# EAGLE design Main (EAGLE 7.6.0)
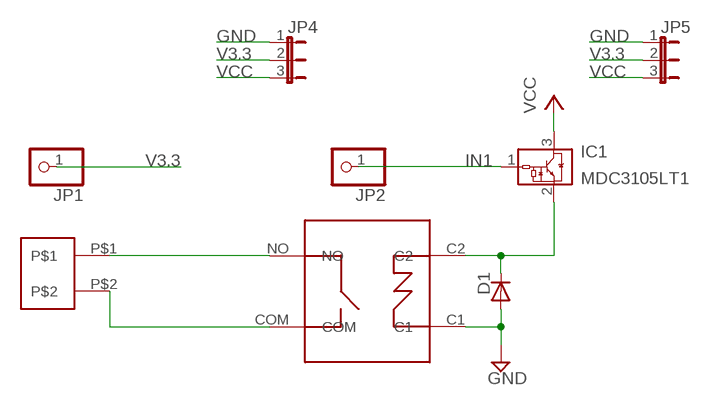
[diagram p0: schematic, sheet 1]

## Parts
D1  DIODE-SOD123  [SOD123]
IC1  MDC3105LT1  [SOT23]
JP1  PINHD-1X1  [1X01]
JP2  PINHD-1X1  [1X01]
JP4  JP2E  [JP2]
JP5  JP2E  [JP2]
REL1  ALQ305  [ALQ305]
U$2  1713017  [1713017]

## Nets
GND [PWR]: D1.A JP4.1 JP5.1 REL1.C1
IN1: IC1.1(VIN) JP2.1
N$1: D1.C IC1.2(GND) REL1.C2
P$1: REL1.NO U$2.P$1
P$2: REL1.COM U$2.P$2
V3.3 [PWR]: JP1.1 JP4.2 JP5.2
VCC [PWR]: IC1.3(VOUT) JP4.3 JP5.3

## Library data of the parts
D1 = diode:DIODE-: DIODE
IC1 = on-semiconductor:MDC3105LT1: Integrated Relay, Inductive Load Driver Sopurce: U6 OnSemi Inductive Load Driver MDC3105-D.PDF; MF: ON SEMICONDUCTOR; MPN: MDC3105LT1; OC_FARNELL: 1126459; OC_NEWARK: 16F6132
JP1 JP2 = pinhead:PINHD-1X1: PIN HEADER
JP4 JP5 = jumper:JP2E: JUMPER
REL1 = library:ALQ305
U$2 = library:1713017

## Net classes
1 230V: width 1.27 mm, clearance 2.54 mm
2 PWR: width 0.635 mm, clearance 1.27 mm

## Board
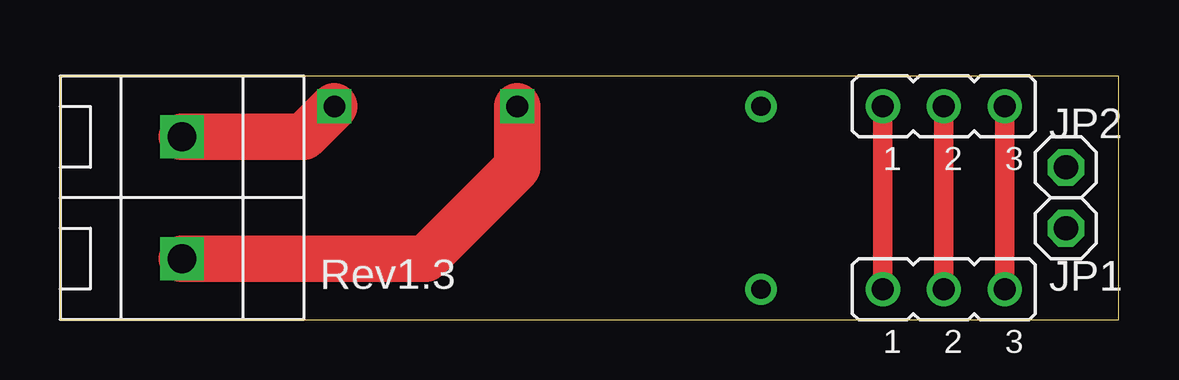
[diagram p1: board, top side]
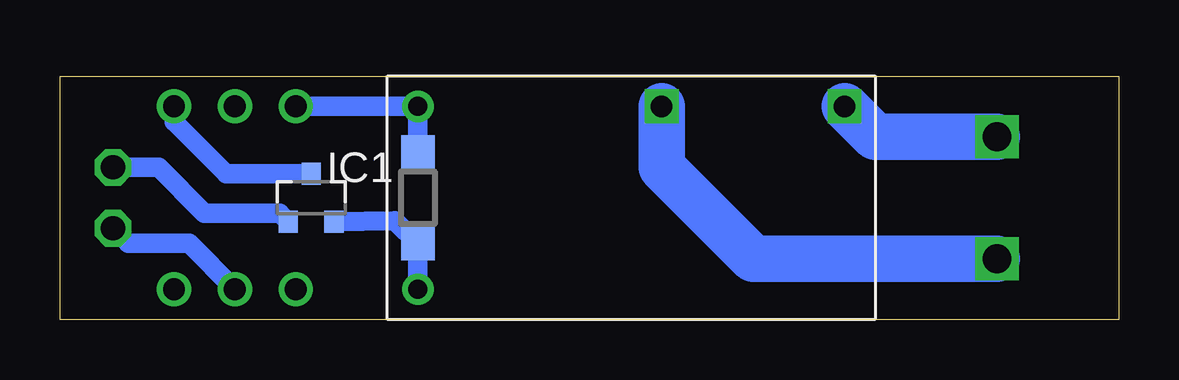
[diagram p2: board, bottom side, seen from below]

Size 44.12 x 10.15 mm. Coordinates in mm from the lower left corner, seen from the top.
Outline: 0,0 44.12,0 44.12,10.15 0,10.15 0,0
Copper layers (1*16): Top 0.035mm / dielectric 1.5mm / Bottom 0.035mm
Design rules "default": minimum track width 10mil, minimum drill 24mil, track to track 8mil, track to pad 8mil, pad to pad 8mil, via to via 8mil, smd to smd 8mil, copper to edge 40mil, drill to drill 8mil, minimum pad ring 10mil, minimum via ring 8mil, stop-mask expansion 4mil, vias tented up to drill 0mil, thermal gap 10mil

### Footprints (pad centres in the part's own frame; a part is rotated, then mirrored left to right if it is on the bottom)
SOD123 = smd 1.4 x 1.4: A 1.9,0; C -1.9,0
SOT23 = smd 0.8 x 0.9: 1 -0.95,-1; 2 0.95,-1; 3 0,1
1X01 = drill 1.016 octagon: 1 0,0
JP2 = drill 0.914: 1 -2.54,0; 2 0,0; 3 2.54,0
ALQ305 = drill 0.8: C1 -8.89,3.81; C2 -8.89,-3.81 | drill 0.9 square: COM 1.27,3.81; NO 8.89,3.81
1713017 = drill 1.2 square: P$1 -2.54,0; P$2 2.54,0

### Placement (x,y rotation side)
D1  29.21,5.08 90 bottom
IC1  33.66,5.08 0 bottom
JP1  41.91,3.81 0 top
JP2  41.91,6.35 0 top
JP4  36.83,1.27 0 top
JP5  36.83,8.89 0 top
REL1  20.32,5.08 0 bottom
U$2  5.08,5.08 270 top

### Tracks (layer width: path | path; a pad name or v marks a point on that pad's centre or on a via)
GND
  Top 0.813: JP4.1 JP5.1
  Bottom 0.813: JP5.1 REL1.C1 D1.A
IN1
  Bottom 0.813: JP2.1 40.01,6.35 38.1,4.45 34.97,4.45 IC1.1
N$1
  Bottom 0.813: REL1.C2 D1.C 30.16,4.13 IC1.2
P$1
  Top 1.93: U$2.P$1 10.16,7.62 REL1.NO
  Bottom 1.93: U$2.P$1 10.16,7.62 REL1.NO
P$2
  Top 1.93: U$2.P$2 15.24,2.54 19.05,6.35 REL1.COM
  Bottom 1.93: U$2.P$2 15.24,2.54 19.05,6.35 REL1.COM
V3.3
  Top 0.813: JP4.2 JP5.2
  Bottom 0.813: JP4.2 38.73,3.17 41.27,3.17 JP1.1
VCC
  Top 0.813: JP4.3 JP5.3
  Bottom 0.813: IC1.3 37.2,6.08 39.37,8.26 JP5.3

### Text on the board
tNames: Rev1.3